# Altium project FYP_PPG_board.PrjPcb
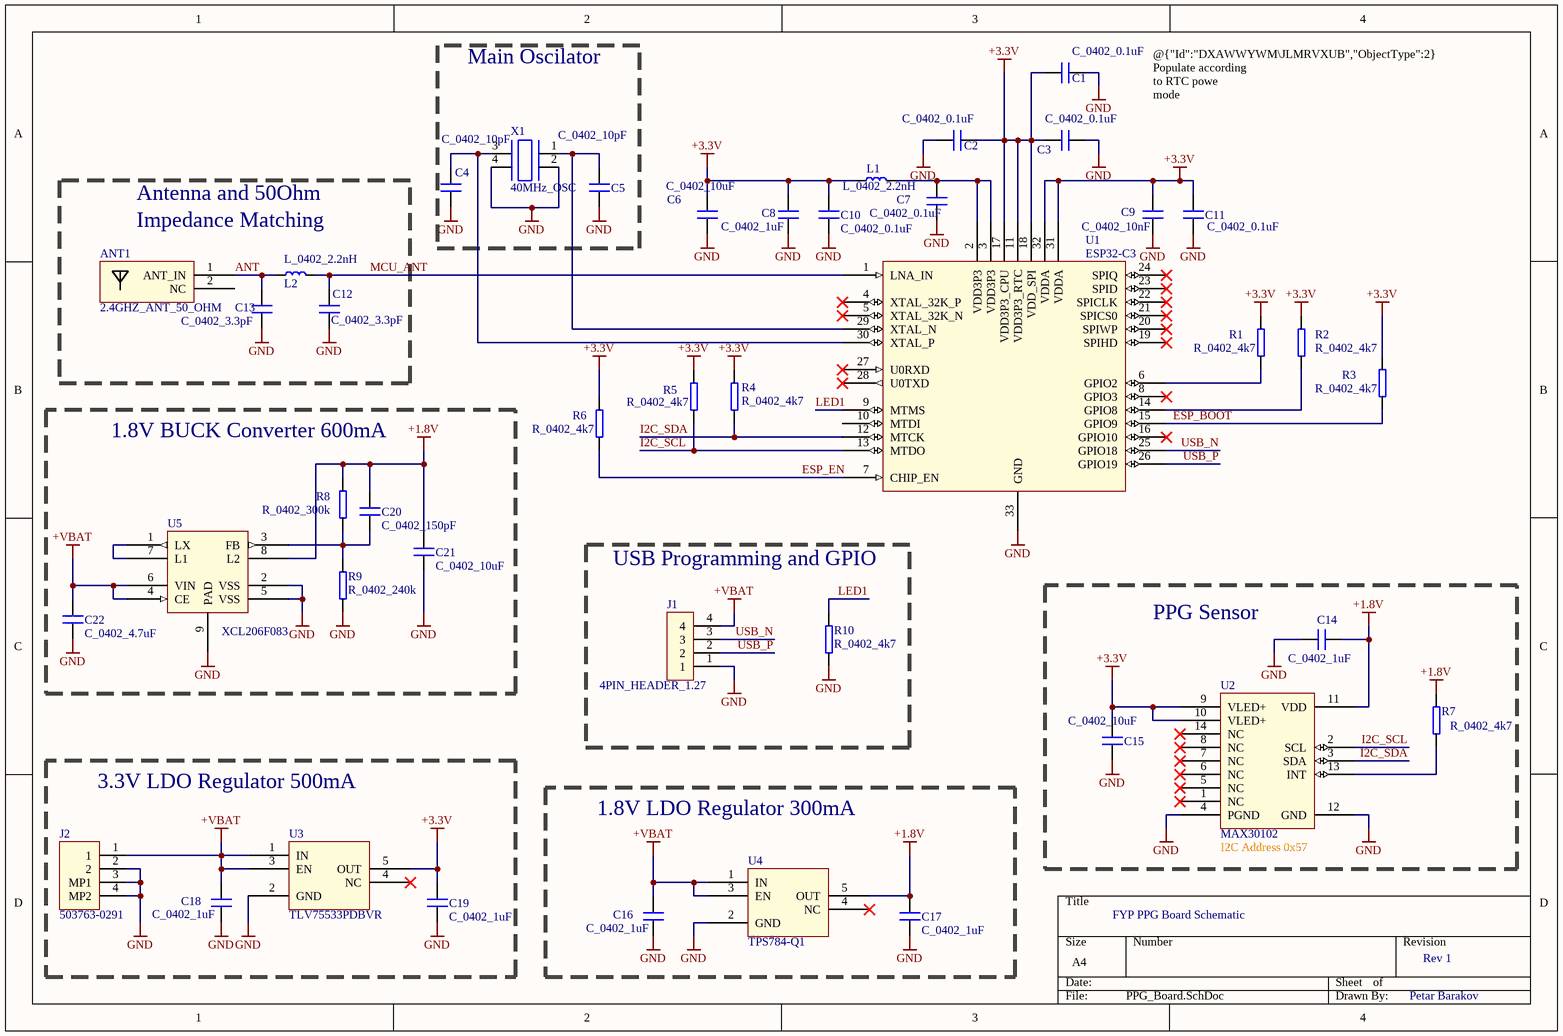
[diagram p0: PPG_Board.SchDoc]
Author: Petar Barakov; Revision: Rev 1
1 sheet, 43 parts. Net scope: global (net labels, ports and power ports of the same name join across sheets).
Board file: PPG_Board.PcbDoc

## Sheet PPG_Board.SchDoc
size A4; SheetNumber: 1; SheetTotal: 1

### Parts
ANT1  2.4GHZ_ANT_50_OHM  [Chip2PinSM127P600-8N]
C1  C_0402_0.1uF  [C_0402]
C2  C_0402_0.1uF  [C_0402]
C3  C_0402_0.1uF  [C_0402]
C4  C_0402_10pF  [C_0402]
C5  C_0402_10pF  [C_0402]
C6  C_0402_10uF  [C_0402]
C7  C_0402_0.1uF  [C_0402]
C8  C_0402_1uF  [C_0402]
C9  C_0402_10nF  [C_0402]
C10  C_0402_0.1uF  [C_0402]
C11  C_0402_0.1uF  [C_0402]
C12  C_0402_3.3pF  [C_0402]
C13  C_0402_3.3pF  [C_0402]
C14  C_0402_1uF  [C_0402]
C15  C_0402_10uF  [C_0402]
C16  C_0402_1uF  [C_0402]
C17  C_0402_1uF  [C_0402]
C18  C_0402_1uF  [C_0402]
C19  C_0402_1uF  [C_0402]
C20  C_0402_150pF  [C_0402]
C21  C_0402_10uF  [C_0402]
C22  C_0402_4.7uF  [C_0402]
J1  4PIN_HEADER_1.27  [4PIN_HEADER_1.27-Footprint-1]
J2  503763-0291  [Molex 503763-0291]
L1  L_0402_2.2nH  [L_0402]
L2  L_0402_2.2nH  [L_0402]
R1  R_0402_4k7  [R_0402]
R2  R_0402_4k7  [R_0402]
R3  R_0402_4k7  [R_0402]
R4  R_0402_4k7  [R_0402]
R5  R_0402_4k7  [R_0402]
R6  R_0402_4k7  [R_0402]
R7  R_0402_4k7  [R_0402]
R8  R_0402_300k  [R_0402]
R9  R_0402_240k  [R_0402]
R10  R_0402_4k7  [R_0402]
U1  ESP32-C3  [QFN127P600-8N]
U2  MAX30102  [MAX30102-Footprint-1]
U3  TLV75533PDBVR  [SOT95P280X145-5N]
U4  TPS784-Q1  [SOT95P280X145-5N]
U5  XCL206F083  [XCL206F083-Footprint-1]
X1  40MHz_OSC  [40MHz_OSC-Footprint-1]

### Blocks framed on the sheet
Main Oscilator: C4 C5 X1
1.8V BUCK Converter 600mA: C20-C22 R8 R9 U5
USB Programming and GPIO: J1 R10
PPG Sensor: C14 C15 R7 U2
3.3V LDO Regulator 500mA: C18 C19 J2 U3
1.8V LDO Regulator 300mA: C16 C17 U4

### Nets
+1.8V: C14.2 C17.2 C20.2 C21.2 R7.2 R8.1 U2.11(VDD) U4.5(OUT) U5.8(L2)
+3.3V: C1.1 C2.2 C3.1 C6.2 C8.2 C9.2 C10.1 C11.2 C15.2 C19.2 L1.1 R1.1 R2.1 R3.1 R4.1 R5.1 R6.1 U1.11(VDD3P3_RTC) U1.17(VDD3P3_CPU) U1.18(VDD_SPI) U1.31(VDDA) U1.32(VDDA) U2.9(VLED+) U2.10(VLED+) U3.5(OUT)
+VBAT: C16.2 C18.2 C22.2 J1.4 J2.1 U3.1(IN) U3.3(EN) U4.1(IN) U4.3(EN) U5.4(CE) U5.6(VIN)
GND: C1.2 C2.1 C3.2 C4.1 C5.1 C6.1 C7.2 C8.1 C9.1 C10.2 C11.1 C12.1 C13.1 C14.1 C15.1 C16.1 C17.1 C18.1 C19.1 C21.1 C22.1 J1.1 J2.2 J2.3(MP1) J2.4(MP2) R9.2 R10.2 U1.33(GND) U2.4(PGND) U2.12(GND) U3.2(GND) U4.2(GND) U5.2(VSS) U5.5(VSS) U5.9(PAD) X1.2 X1.4
ANT: ANT1.1(ANT_IN) C13.2 L2.1
ESP_BOOT: R3.2 U1.15(GPIO9)
ESP_EN: R6.2 U1.7(CHIP_EN)
I2C_SCL: R5.2 U1.13(MTDO) U2.2(SCL)
I2C_SDA: R4.2 U1.12(MTCK) U2.3(SDA)
LED1: R10.1 U1.9(MTMS)
MCU_ANT: C12.2 L2.2 U1.1(LNA_IN)
USB_N: J1.3 U1.25(GPIO18)
USB_P: J1.2 U1.26(GPIO19)
NetC4_2: C4.2 U1.30(XTAL_P) X1.3
NetC5_2: C5.2 U1.29(XTAL_N) X1.1
NetC7_1: C7.1 L1.2 U1.2(VDD3P3) U1.3(VDD3P3)
NetC20_1: C20.1 R8.2 R9.1 U5.3(FB)
NetR1_2: R1.2 U1.6(GPIO2)
NetR2_2: R2.2 U1.14(GPIO8)
NetR7_1: R7.1 U2.13(INT)
NetU5_1: U5.1(LX) U5.7(L1)

Not connected (* = marked no-connect by the designer): ANT1 2(NC); U1 4(XTAL_32K_P)* 5(XTAL_32K_N)* 8(GPIO3)* 10(MTDI) 16(GPIO10)* 19(SPIHD)* 20(SPIWP)* 21(SPICS0)* 22(SPICLK)* 23(SPID)* 24(SPIQ)* 27(U0RXD)* 28(U0TXD)*; U2 1(NC)* 5(NC)* 6(NC)* 7(NC)* 8(NC)* 14(NC)*; U3 4(NC)*; U4 4(NC)*

### Notes on the sheet
- @{"Id":"DXAWWYWM\JLMRVXUB","ObjectType":2}  Populate according to RTC powe mode configurations
- Antenna and 50Ohm
- Impedance Matching
- (near U2) I2C Address 0x57
- FYP PPG Board Schematic

### Library data of the parts
ANT1 = CMP-00009-6: 2.4GHz Chip Antenna 50 Ohm Impedance ANT2012LL00R2400A; Order Code: 603-ANT2012LL00R2400; Distributor: Mouser
C1-C3 C7 C10 C11 = CMP-00055-1: JLC Part Number: C1525
C4 C5 = CMP-00051-1: JLC Part Number: C32949
C6 C15 C21 = CMP-00052-1: JLC Part Number: C15525
C8 C14 C16-C19 = CMP-00053-1: JLC Part Number: C52923
C9 = CMP-00054-1: JLC Part Number: C15195
C12 C13 = CMP-00056-1: JLC Part Number: C326841
C20 = CMP-00060-1: JLC Part Number: C363531
C22 = CMP-00058-1: JLC Part Number: C23733
J1 = CMP-00049-2: Order Code: 855-M50-3530442; Distributor: Mouser
J2 = CMP-007-000000-2: Molex 503763-0291; Order Code: 538-503763-0291; Design Item ID: 503763-0291; Distributor: Mouser
L1 L2 = CMP-00057-1: JLC Part Number: C92035
R1-R7 R10 = CMP-00050-1: JLC Part Number: C25900
R8 = CMP-00061-1: JLC Part Number: C100363
R9 = CMP-00062-1: JLC Part Number: C429390
U1 = CMP-00008-4: 33 pin ESP32_C3 Microcontroller; JLC Part Number: C2858491
U2 = CMP-00048-2: Biometric Sensors Integrated Optical Sensor; Order Code: 700-MAX30102EFD+T; JLC Part Number: C6454833; Distributor: Mouser
U3 = CMP-00019-2: LDO Voltage Regulators 500-mA high-PSRR low-IQ low-dropout voltage regulator with enable 5-SOT-23 -40 to 125; JLC Part Number: C404027
U4 = CMP-00023-2: LDO Voltage Regulators Automotive, 300-mA, low-IQ, high-PSRR, LDO voltage regulator with high accuracy and enable 5-SOT-23 -40 to 150; Order Code: 595-TPS78418QDBVRQ1; Distributor: Mouser; JLC Part Number: C2877783
U5 = CMP-00059-2: Switching Voltage Regulators 600mA Inductor Built-in PWM Step-Down microDCDC Converter; JLC Part Number: C2891283
X1 = CMP-00029-2: 40 MHZ Oscillator, 10pF load capacitance; JLC Part Number: C426988

## Assembly variants
V1: not fitted ANT1 C16 C17 J1 J2 R10 U4
V2_3d_images: not fitted C16 C17 J1 R10 U4